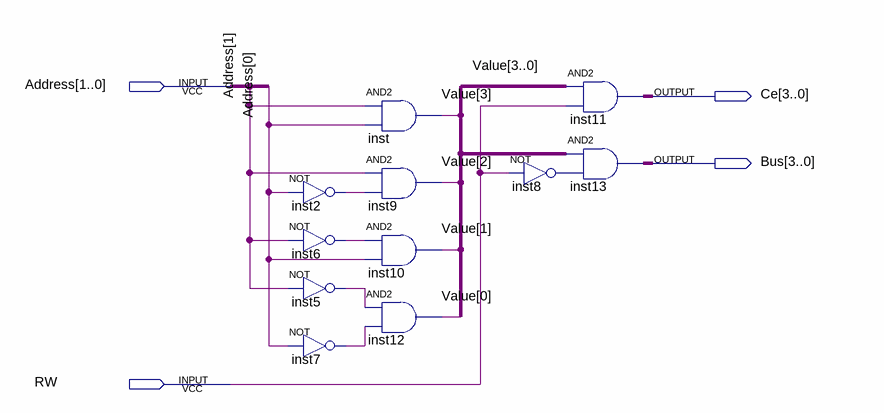
[diagram p0: schematic sheet]
// Quartus schematic Selector.bdf as structural Verilog: 11 symbols, 4 pins
module Selector (
  input  [1:0] Address,
  input  RW,
  output [3:0] Ce,
  output [3:0] Bus
);

  wire inst2_out, inst5_out, inst6_out, inst7_out, inst8_out;
  wire [3:0] Value;

  not inst2 (inst2_out, Address[0]);
  not inst6 (inst6_out, Address[1]);
  not inst5 (inst5_out, Address[1]);
  not inst7 (inst7_out, Address[0]);
  and inst (Value[3], Address[1], Address[0]);
  and inst9 (Value[2], Address[1], inst2_out);
  and inst10 (Value[1], inst6_out, Address[0]);
  and inst12 (Value[0], inst5_out, inst7_out);
  assign Ce = Value & {4{RW}};  // AND2 inst11, 4 bits wide
  assign Bus = Value & {4{inst8_out}};  // AND2 inst13, 4 bits wide
  not inst8 (inst8_out, RW);
endmodule
